# EasyEDA schematic SCH_Desky_2024-12-20.json
TITLE: Sheet_1; REV: 1.0; Date: 2024-12-13; Sheet: 1/1; Drawn By: briyangd; Company: Your Company
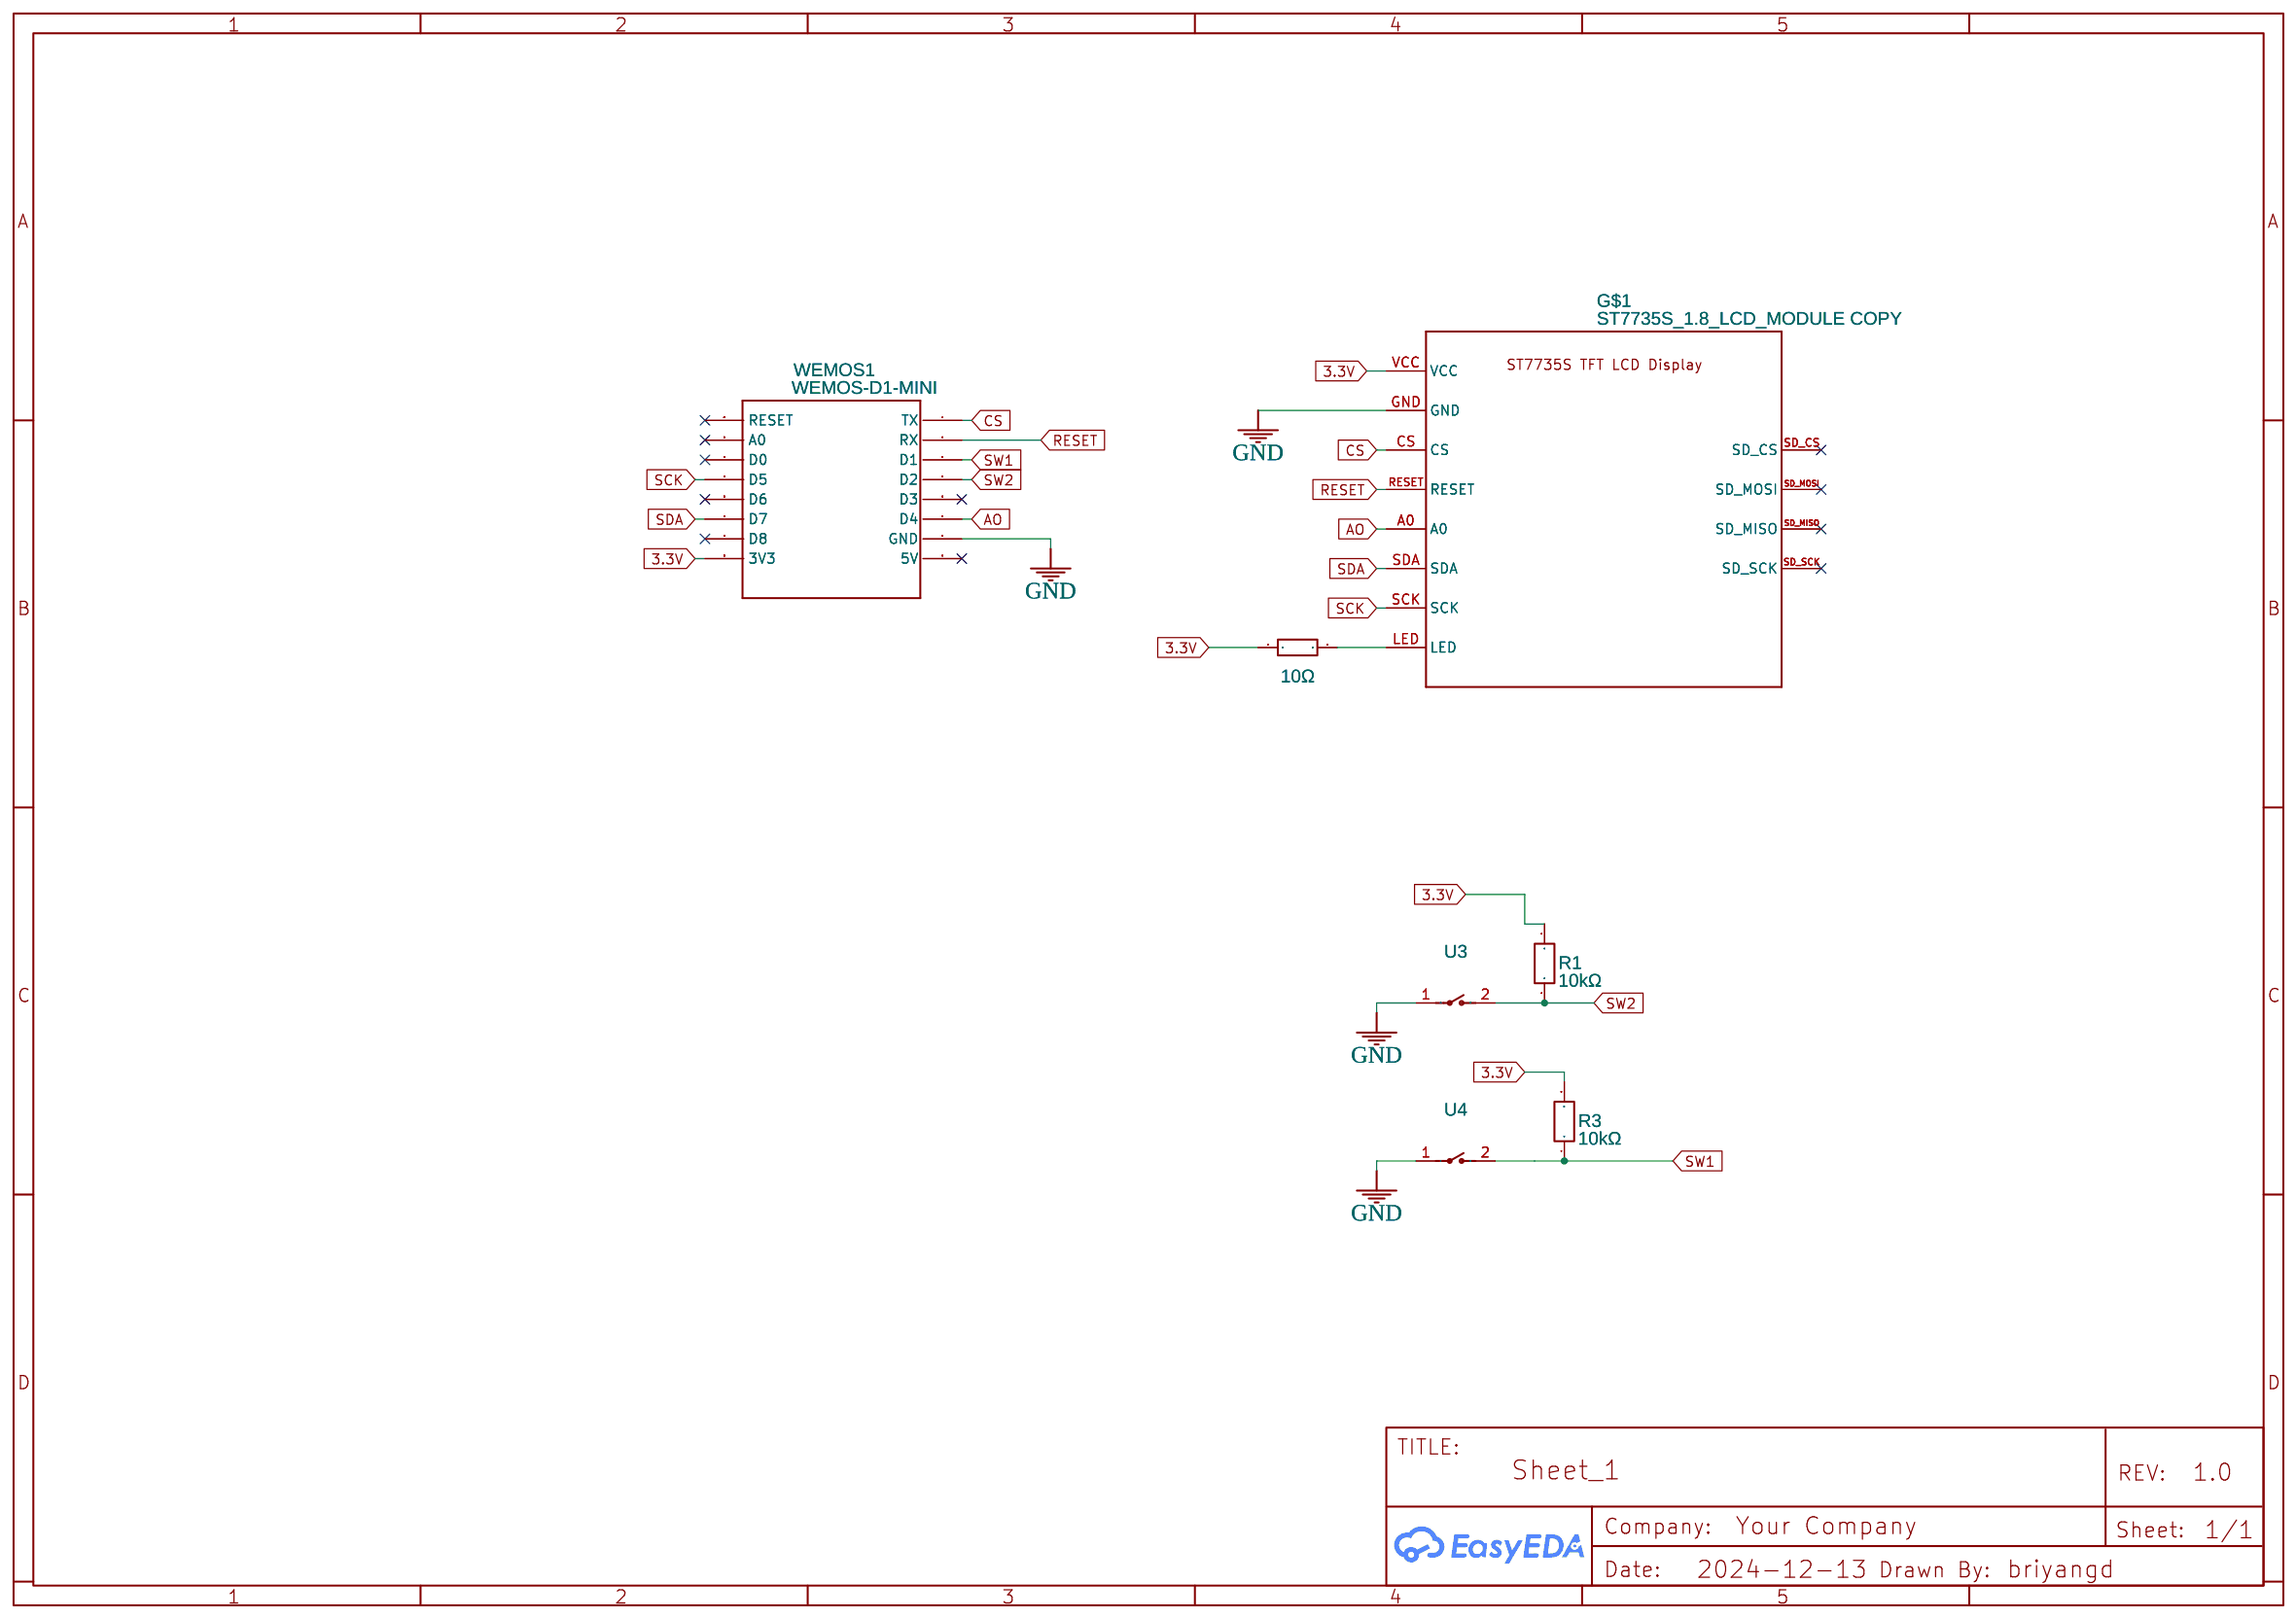
[diagram p0: schematic sheet]

## Parts
G$1  ST7735S_1.8_LCD_MODULE COPY  [ST7735S_LCD_DISPLAY]
R1  10kΩ  [RES-TH_BD2.4-L6.3-P10.30-D0.6]
R2  10Ω  [RES-TH_BD5.0-L15.5-P19.50-D0.7]
R3  10kΩ  [RES-TH_BD2.4-L6.3-P10.30-D0.6]
U3  EVQ-11D05B  [KEY-TH_L6.0-W6.0-P5.00]
U4  EVQ-11D05B  [KEY-TH_L6.0-W6.0-P5.00]
WEMOS1  WEMOS-D1-MINI  [WEMOS-D1-MINI]

## Library data of the parts
G$1 = ST7735S_1.8_LCD_MODULE COPY: Contributor: nawapoln
R1 R3 = RN 1/4W 10K F T/B A1: Contributor: LCSC; Supplier: LCSC; Supplier Part: C410695; Manufacturer: Tyohm(幸亚电阻); Manufacturer Part: RN1/4W10KFT/BA1; JLCPCB Part Class: Extended Part
R2 = KNP2W-10Ω±5% T: Contributor: LCSC; Supplier: LCSC; Supplier Part: C122131; Manufacturer: CCO(千志电子); JLCPCB Part Class: Extended Part
U3 U4 = EVQ-11D05B: Supplier: LCSC; Supplier Part: C19544491; Manufacturer: PANASONIC(松下); Contributor: lcsc; JLCPCB Part Class: Extended Part
WEMOS1 = WEMOS-D1-MINI: Contributor: stufi1983

## Nets
3.3V: G$1.VCC R1.2 R2.1 R3.2 WEMOS1.3V3
GND: G$1.GND U3.1 U4.1 WEMOS1.GND
AO: G$1.A0 WEMOS1.D4
CS: G$1.CS WEMOS1.TX
RESET: G$1.RESET WEMOS1.RX
SCK: G$1.SCK WEMOS1.D5
SDA: G$1.SDA WEMOS1.D7
SW1: R3.1 U4.2 WEMOS1.D1
SW2: R1.1 U3.2 WEMOS1.D2
Net-(G$1-LED): G$1.LED R2.2

Not connected (* = marked no-connect by the designer): G$1 SD_CS* SD_MISO* SD_MOSI* SD_SCK*; WEMOS1 5V* A0* D0* D3* D6* D8* RESET*
